# Altium schematic sheet MCU_board_2.SchDoc
size A4; SheetNumber: 2; SheetTotal: 3
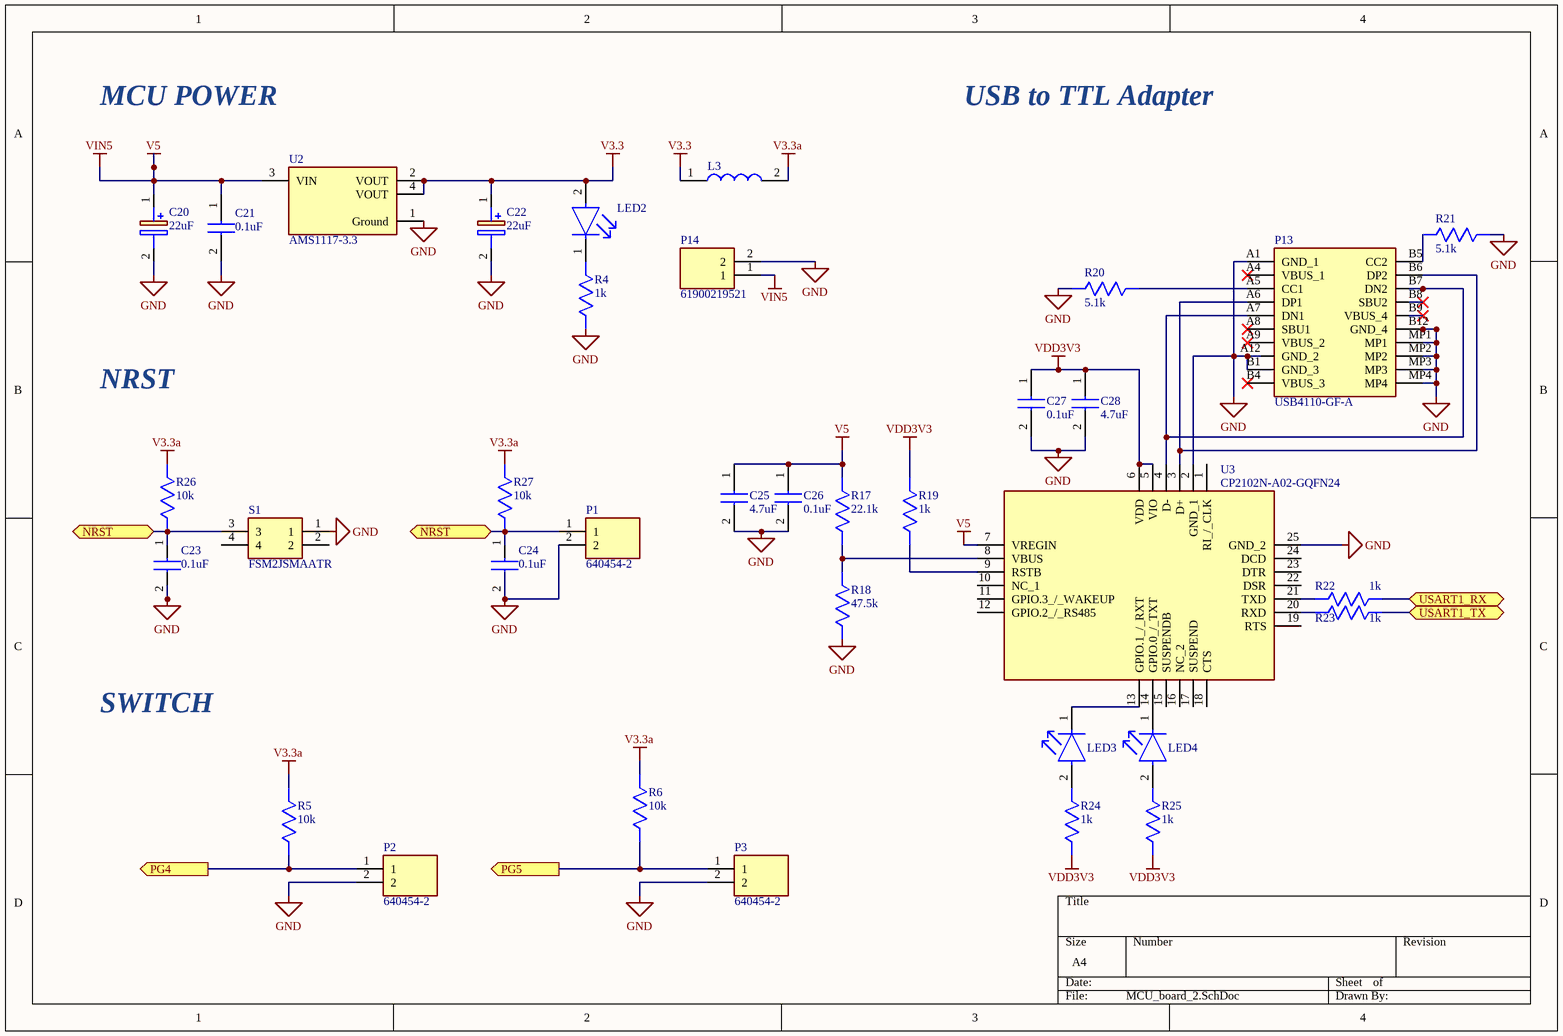
[diagram p0: MCU_board_2.SchDoc]

## Parts
C20  22uF  [CAPPM6032X280N]
C21  0.1uF  [C1608_Commercial]
C22  22uF  [CAPPM6032X280N]
C23  0.1uF  [C1608_Commercial]
C24  0.1uF  [C1608_Commercial]
C25  4.7uF  [CAPC1608X90N]
C26  0.1uF  [CAPC1608X90N]
C27  0.1uF  [CAPC1608X90N]
C28  4.7uF  [CAPC1608X90N]
L3  742792691  [LEDC1608X80N]  (value not drawn)
LED2  150060RS75000  [FP-150060RS75000-MFG]  (value not drawn)
LED3  150060RS75000  [FP-150060RS75000-MFG]  (value not drawn)
LED4  150060RS75000  [FP-150060RS75000-MFG]  (value not drawn)
P1  640454-2  [HDRV2W66P0X254_1X2_762X572X1003P]
P2  640454-2  [HDRV2W66P0X254_1X2_762X572X1003P]
P3  640454-2  [HDRV2W66P0X254_1X2_762X572X1003P]
P13  USB4110-GF-A  [USB4110GFA]
P14  61900219521  [SHDRRA2W64P0X254_1X2_508X1150X595P]
R4  1k  [RESC1608X55N]
R5  10k  [RESC1608X55N]
R6  10k  [RESC1608X55N]
R17  22.1k  [RESC1608X55N]
R18  47.5k  [RESC1608X55N]
R19  1k  [RESC1608X55N]
R20  5.1k  [RESC1608X55N]
R21  5.1k  [RESC1608X55N]
R22  1k  [RESC1608X55N]
R23  1k  [RESC1608X55N]
R24  1k  [RESC1608X55N]
R25  1k  [RESC1608X55N]
R26  10k  [RESC1608X55N]
R27  10k  [RESC1608X55N]
S1  FSM2JSMAATR  [FSM2J_1]
U2  AMS1117-3.3  [FP-AMS1117-IPC_C]
U3  CP2102N-A02-GQFN24  [QFN50P400X400X80-25N-D]

## Ports
NRST (bidir, see MCU_board_1[3A], MCU_board_2[1C], MCU_board_3[1C]), NRST (bidir, see MCU_board_1[3A], MCU_board_2[2C], MCU_board_3[1C]), PG4 (out, see MCU_board_1[3B]), PG5 (out, see MCU_board_1[3B]), USART1_RX (bidir, see MCU_board_1[1C], MCU_board_3[1A]), USART1_TX (bidir, see MCU_board_1[1C], MCU_board_3[1A])

## Nets
GND: C20.2(-) C21.2 C22.2(-) C23.2 C24.2 C25.2 C26.2 C27.2 C28.2 P1.2 P2.2 P3.2 P13.A1(GND_1) P13.A12(GND_2) P13.B1(GND_3) P13.B12(GND_4) P13.MP1 P13.MP2 P13.MP3 P13.MP4 P14.2 R4.2 R18.2 R20.2 R21.2 S1.1 U2.1(Ground) U3.2(GND_1) U3.25(GND_2)
V3.3: C22.1(+) L3.1 LED2.2(A) U2.2(VOUT) U2.4(VOUT)
V3.3a: L3.2 R5.2 R6.2 R26.2 R27.2
V5: C20.1(+) C21.1 C25.1 C26.1 P14.1 R17.1 U2.3(VIN) U3.7(VREGIN)  [also labelled VIN5]
VDD3V3: C27.1 C28.1 R19.1 R24.2 R25.2 U3.5(VIO) U3.6(VDD)
NRST: C23.1 C24.1 P1.1 R26.1 R27.1 S1.3 ; port NRST
PG4: P2.1 R5.1 ; port PG4
PG5: P3.1 R6.1 ; port PG5
USART1_RX: R22.2 ; port USART1_RX
USART1_TX: R23.2 ; port USART1_TX
NetLED2_1: LED2.1(C) R4.1
NetLED3_1: LED3.1(C) U3.13(GPIO.1_/_RXT)
NetLED3_2: LED3.2(A) R24.1
NetLED4_1: LED4.1(C) U3.14(GPIO.0_/_TXT)
NetLED4_2: LED4.2(A) R25.1
NetP13_A5: P13.A5(CC1) R20.1
NetP13_A6: P13.A6(DP1) P13.B6(DP2) U3.3(D+)
NetP13_A7: P13.A7(DN1) P13.B7(DN2) U3.4(D-)
NetP13_B5: P13.B5(CC2) R21.1
NetR17_2: R17.2 R18.1 U3.8(VBUS)
NetR19_2: R19.2 U3.9(RSTB)
NetR22_1: R22.1 U3.21(TXD)
NetR23_1: R23.1 U3.20(RXD)

Not connected (* = marked no-connect by the designer): P13 A4(VBUS_1)* A8(SBU1)* A9(VBUS_2)* B4(VBUS_3)* B8(SBU2)* B9(VBUS_4)*; S1 2 4; U3 1(RI_/_CLK) 10(NC_1) 11(GPIO.3_/_WAKEUP) 12(GPIO.2_/_RS485) 15(SUSPENDB) 16(NC_2) 17(SUSPEND) 18(CTS) 19(RTS) 22(DSR) 23(DTR) 24(DCD)

## Notes on the sheet
- MCU POWER
- USB to TTL Adapter
- NRST
- SWITCH

## Library data of the parts
C20 C22 = TAJC226K025RNJ: Capacitor Polarised; Manufacturer_Name: AVX; Datasheet Link: http://datasheets.avx.com/TAJ.pdf; Height: 2.8mm; Manufacturer_Part_Number: TAJC226K025RNJ; Mouser Part Number: 581-TAJC226K025R; Mouser Price/Stock: https://www.mouser.co.uk/ProductDetail/AVX/TAJC226K025RNJ?qs=ZfDiupplM3TXvWbrzYGnnA%3D%3D; Arrow Part Number: TAJC226K025RNJ; Arrow Price/Stock: https://www.arrow.com/en/products/tajc226k025rnj/avx
C21 C23 C24 = C1608X7R1H334K080AC: Capacitor; Manufacturer_Name: TDK; Datasheet Link: https://product.tdk.com/system/files/dam/doc/product/capacitor/ceramic/mlcc/catalog/mlcc_commercial_general_en.pdf; Height: 0.9mm; Manufacturer_Part_Number: C1608X7R1H334K080AC; Mouser Part Number: 810-C1608X7R1H334K; Mouser Price/Stock: https://www.mouser.co.uk/ProductDetail/TDK/C1608X7R1H334K080AC?qs=NRhsANhppD%252BuOqJgCMjUlg%3D%3D; Arrow Part Number: C1608X7R1H334K080AC; Arrow Price/Stock: https://www.arrow.com/en/products/c1608x7r1h334k080ac/tdk
C25-C28 = GRM188R72A104MA35D: Capacitor; Manufacturer_Name: Murata Electronics; Height: 0.9mm; Manufacturer_Part_Number: GRM188R72A104MA35D; Mouser Part Number: 81-GRM188R72A104MA5D; Mouser Price/Stock: https://www.mouser.co.uk/ProductDetail/Murata-Electronics/GRM188R72A104MA35D?qs=QdePRyQsNGaEtttrWFG%2FPQ%3D%3D; Arrow Part Number: GRM188R72A104MA35D; Arrow Price/Stock: https://www.arrow.com/en/products/grm188r72a104ma35d/murata-manufacturing?region=nac
L3 = 742792691: Inductor; Manufacturer_Name: Wurth Elektronik; Height: 0.8mm; Manufacturer_Part_Number: 742792691; Mouser Part Number: 710-742792691; Mouser Price/Stock: https://www.mouser.com/Search/Refine.aspx?Keyword=710-742792691
LED2-LED4 = CMP-1426-00001-2: LED RED CLEAR 0603 SMD; Luminous Intensity: 250mcd; Viewing Angle: 140°; Dominant Wavelength: 625nm; Test Current: 20mA; Forward Current: 30mA; Forward Voltage: 2V; Lens Color: Colorless; Lens Size: 0.7mm; Width: 0.8mm; Series: WL-SMCW; Color: Red; Min Operating Temperature: -40°C; RoHS Compliant: Yes; Height: 0.8mm; Package Quantity: 1; Packaging: Cut Tape; Mount: Surface Mount; Case/Package: 0603; Lens Transparency: Clear; Length: 1.6mm; Case Code (Imperial): 0603; Lens Style: Clear; Wavelength: 625nm; Max Operating Temperature: 85°C; Case Code (Metric): 1608
P1-P3 = 640454-2: Connector; Manufacturer_Name: TE Connectivity; Datasheet Link: https://datasheet.datasheetarchive.com/originals/distributors/Datasheets_SAMA/0152b3901a0ba380c7a54e62cba96e15.pdf; Height: 10.03mm; Manufacturer_Part_Number: 640454-2
P13 = USB4110-GF-A: Connector; Manufacturer_Name: GCT (GLOBAL CONNECTOR TECHNOLOGY); Datasheet Link: https://gct.co/files/drawings/usb4110.pdf; Height: 3.26mm; Manufacturer_Part_Number: USB4110-GF-A; Mouser Part Number: 640-USB4110-GF-A; Mouser Price/Stock: https://www.mouser.co.uk/ProductDetail/GCT/USB4110-GF-A?qs=KUoIvG%2F9IlYiZvIXQjyJeA%3D%3D
P14 = 61900219521: Connector; Manufacturer_Name: Wurth Elektronik; Datasheet Link: https://componentsearchengine.com/Datasheets/1/61900219521.pdf; Height: 5.95mm; Manufacturer_Part_Number: 61900219521; Mouser Part Number: 710-61900219521; Mouser Price/Stock: https://www.mouser.co.uk/ProductDetail/Wurth-Elektronik/61900219521?qs=W%252B2sBeLta1aXbrC28D3FtA%3D%3D
R4-R6 R17-R27 = CMP0603-FX-1003ELF: Resistor; Manufacturer_Name: Bourns; Datasheet Link: https://www.mouser.co.uk/datasheet/2/54/Bourns_CMP_Datasheet_05.28.20-1854233.pdf; Height: 0.55mm; Manufacturer_Part_Number: CMP0603-FX-1003ELF
S1 = FSM2JSMAATR: Switch; Manufacturer_Name: TE Connectivity; Datasheet Link: http://www.te.com/commerce/DocumentDelivery/DDEController?Action=showdoc&DocId=Customer+Drawing%7F2-1437565-7%7FV%7Fpdf%7FEnglish%7FENG_CD_2-1437565-7_V.pdf%7F2-1437565-9; Manufacturer_Part_Number: FSM2JSMAATR
U2 = CMP-209535-000001-1: LDO Voltage Regulators 1A, 3.3V; Manufacturer: Advanced Monolithic Systems; Dropout Voltage: 1.1V; Output Type: Fixed; Nominal Supply Current: 5mA; Max Power Dissipation: 1.2W; Max Supply Voltage: 15V; Number Of Outputs: 1; Standoff Height: 0.64mm; Max Junction Temp: +125°C; Height: 1.8mm; Package: AMS1117; Device Class L2: Power Management ICs; ComponentLink2Description: Datasheet; ComponentLink2URL: http://www.advanced-monolithic.com/pdf/ds1117.pdf; Category: IC; RoHS: TRUE; Automotive: No; Device Class L1: Integrated Circuits (ICs); Output Current: 1A; Device Class L3: Voltage Regulators - Linear; Temperature: -40°C to +125°C; Output Voltage: 3.3V; Manufacturer Part Number: AMS1117-3.3; Temperature Range Low: -40°C; Octopart: https://octopart.com/ams1117-3.3-advanced+monolithic+systems-25899300; Lead Free: Yes; Ipc Land Pattern Name: SOT229P700X180-4; Temperature Range High: +125°C
U3 = CP2102N-A02-GQFN24: Integrated Circuit; Manufacturer_Name: Silicon Labs; Datasheet Link: https://componentsearchengine.com/Datasheets/1/CP2102N-A02-GQFN24.pdf; Height: 0.8mm; Manufacturer_Part_Number: CP2102N-A02-GQFN24; Mouser Part Number: 634-CP2102NA02GQFN24; Mouser Price/Stock: https://www.mouser.co.uk/ProductDetail/Silicon-Labs/CP2102N-A02-GQFN24?qs=u16ybLDytRYKabtL%2FE7DZA%3D%3D; Arrow Part Number: CP2102N-A02-GQFN24; Arrow Price/Stock: https://www.arrow.com/en/products/cp2102n-a02-gqfn24/silicon-labs